# Altium schematic sheet SensorPCB.SchDoc
size A4; SheetNumber: 1; SheetTotal: 1
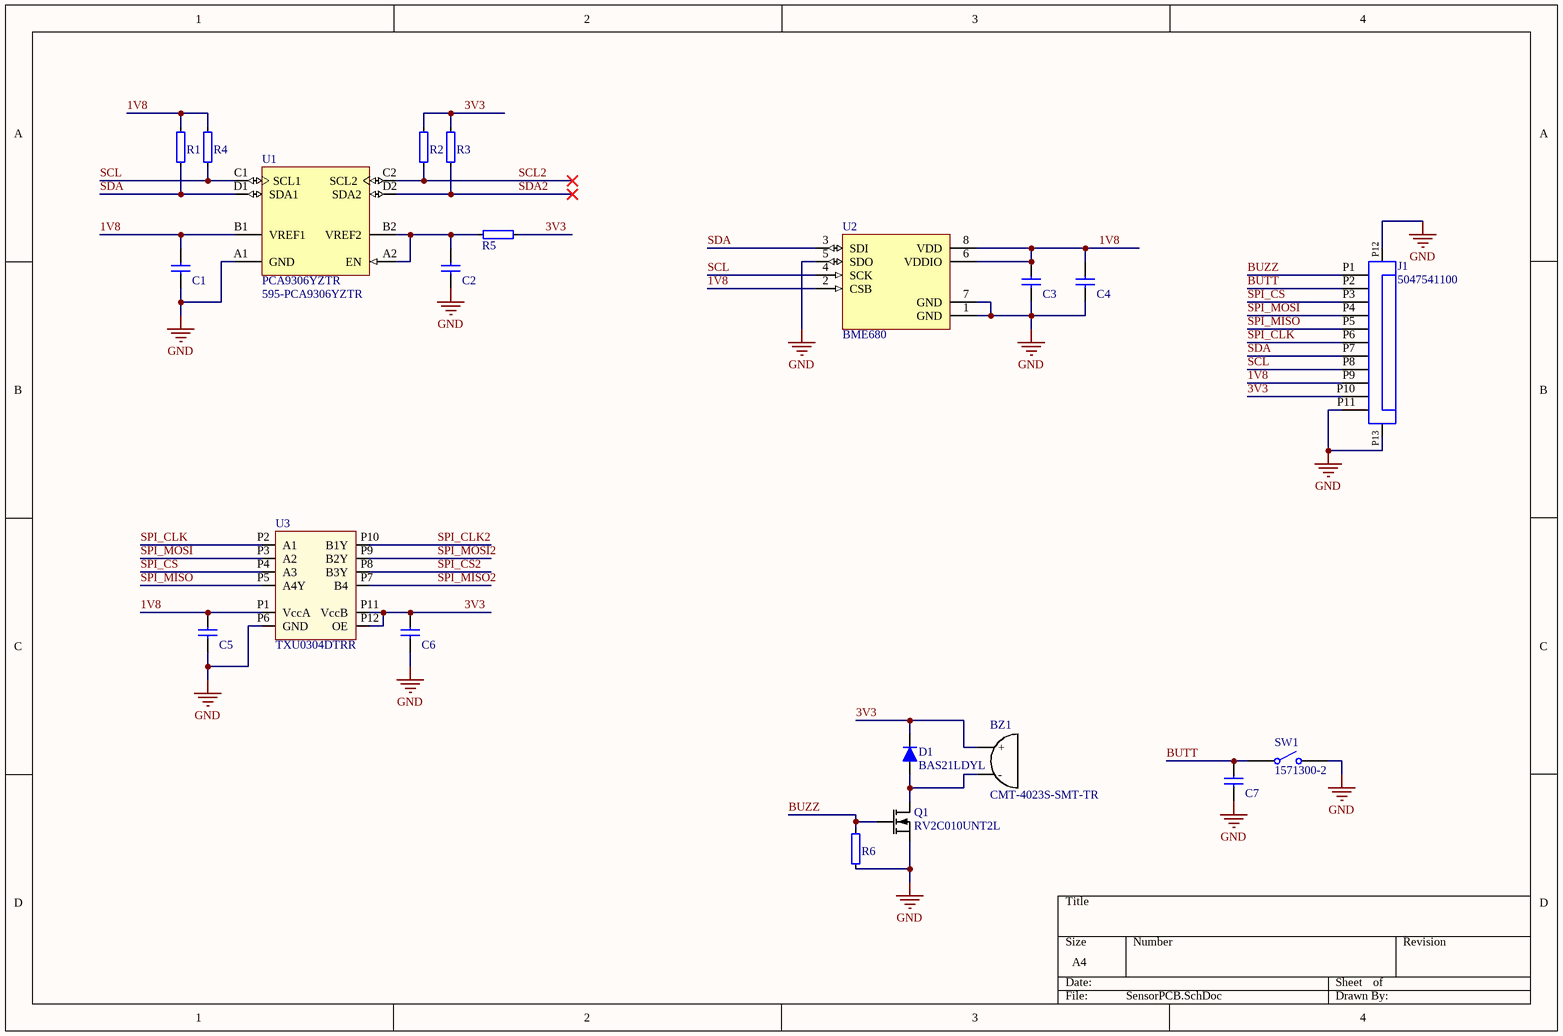
[diagram p0: SensorPCB.SchDoc]

## Parts
BZ1  CMT-4023S-SMT-TR  [CMT-4023S-SMT-TR]
C1  100n  [CAPC0603X03L_C]  (value not drawn)
C2  100n  [CAPC0603X03L_C]  (value not drawn)
C3  100n  [CAPC0603X03L_C]  (value not drawn)
C4  100n  [CAPC0603X03L_C]  (value not drawn)
C5  100n  [CAPC0603X03L_C]  (value not drawn)
C6  100n  [CAPC0603X03L_C]  (value not drawn)
C7  100n  [CAPC0603X03L_C]  (value not drawn)
D1  BAS21LDYL  [BAS21LDYL]
J1  5047541100  [5047541100]
Q1  RV2C010UNT2L  [DFN65P100X40-3L]
R1  4.7k  [RESC0603X03L_C]  (value not drawn)
R2  4.7k  [RESC0603X03L_C]  (value not drawn)
R3  4.7k  [RESC0603X03L_C]  (value not drawn)
R4  4.7k  [RESC0603X03L_C]  (value not drawn)
R5  200k  [RESC0603X03L_C]  (value not drawn)
R6  200k  [RESC0603X03L_C]  (value not drawn)
SW1  1571300-2  [1571300-2]
U1  PCA9306YZTR  Supplier Part Number 1: 595-PCA9306YZTR  [PCA9306YZTR]
U2  BME680  [BME680]
U3  TXU0304DTRR  [TXU0304DTR]

## Nets
GND: C1.1 C2.1 C3.1 C4.1 C5.1 C6.1 C7.1 J1.P11 J1.P12(MP1) J1.P13(MP2) Q1.2(S) R6.2 SW1.P2 U1.A1(GND) U2.1(GND) U2.5(SDO) U2.7(GND) U3.P6(GND)
1V8: C1.2 C3.2 C4.2 C5.2 J1.P9 R1.2 R4.2 U1.B1(VREF1) U2.2(CSB) U2.6(VDDIO) U2.8(VDD) U3.P1(VccA)
3V3: BZ1.P1(+) C6.2 D1.P2(K) J1.P10 R2.2 R3.2 R5.1 U3.P11(VccB) U3.P12(OE)
BUTT: C7.2 J1.P2 SW1.P1
BUZZ: J1.P1 Q1.1(G) R6.1
SCL: J1.P8 R4.1 U1.C1(SCL1) U2.4(SCK)
SCL2: R2.1 U1.C2(SCL2)
SDA: J1.P7 R1.1 U1.D1(SDA1) U2.3(SDI)
SDA2: R3.1 U1.D2(SDA2)
SPI_CLK: J1.P6 U3.P2(A1)
SPI_CLK2: U3.P10(B1Y)
SPI_CS: J1.P3 U3.P4(A3)
SPI_CS2: U3.P8(B3Y)
SPI_MISO: J1.P5 U3.P5(A4Y)
SPI_MISO2: U3.P7(B4)
SPI_MOSI: J1.P4 U3.P3(A2)
SPI_MOSI2: U3.P9(B2Y)
NetBZ1_P2: BZ1.P2(-) D1.P1(A) Q1.3(D)
NetC2_2: C2.2 R5.2 U1.A2(EN) U1.B2(VREF2)

## Library data of the parts
BZ1 = CMT-4023S-SMT-TR: 4 mm, 3 Vo-p, 70 dB, Surface Mount (SMT), Magnetic Audio Transducer Buzzer; Manufacturer: CUI; Voltage Rating: 3V; Frequency: 4kHz; Operating Supply Current: 90mA; Supplier 1: Mouser; Manufacturer Part Number: CMT-4023S-SMT-TR; RoHS: No; Category: Audio Products; Mount: Surface Mount; Min Operating Temperature: -20°C; Max Operating Temperature: 70°C; Sensing Method: Magnetic; Packaging: Tape and Reel; Termination: Solder; Length: 4mm; Width: 4mm; Lead Free: Lead Free; ComponentLink1URL: https://www.cui.com/product/resource/digikeypdf/cmt-4023s-smt.pdf?src-supplier=Digi-Key; ComponentLink1Description: https://www.cui.com/product/resource/digikeypdf/cmt-4023s-smt.pdf?src-supplier=Digi-Key; ComponentLink2URL: http://www.cui.com/product/resource/digikeypdf/cmt-4023s-smt.pdf?src-supplier=Digi-Key; ComponentLink2Description: http://www.cui.com/product/resource/digikeypdf/cmt-4023s-smt.pdf?src-supplier=Digi-Key; Supplier Part Number 1: 490-CMT-4023S-SMT-TR
C1-C7 = C0201
D1 = BAS21LDYL: BAS21LD/SOD882/SOD2; Manufacturer: Nexperia; Supplier 1: Mouser; Manufacturer Part Number: BAS21LDYL; RoHS: No; Stock 1: 752; Pricing 1: 1=0.30000, 10=0.23700, 50=0.23700, 100=0.12600, 1000=0.05700, 10000=0.03900 (USD); Supplier Part Number 1: 771-BAS21LDYL
J1 = 5047541100: Conn FFC/FPC Connector SKT 11 POS 0.3mm Solder RA SMD Easy-On™ T/R; Manufacturer Part Number: 687124182122; Manufacturer: Wurth Elektronik; Pitch: 0.5mm; Contact Resistance: 30mOhm; Pin Number: 24; Working Voltage: 50VAC; Rated Current: 0.5A; ComponentLink1Description: Manufacturer; ComponentLink1URL: http://www.we-online.de; ComponentLink2Description: Datasheet; ComponentLink2URL: https://katalog.we-online.com/em/datasheet/687124182122.pdf; Packaging: Tape and Reel; Published Date: March 2021; Mounting Technology: SMT; Operating Temperature: -25 to +85degC; Length: 14mm; Type: Horizontal; Supplier 1: Mouser; RoHS: No; Category: FFC / FPC; Stock 1: 21094; Pricing 1: 1=0.78000, 10=0.62000, 50=0.62000, 100=0.51700, 500=0.51200, 1000=0.51200, 5000=0.41900, 10000=0.41100, 25000=0.35200 (USD); ComponentLink3URL: https://www.molex.com/pdm_docs/ps/PS-504754-002.pdf?src-supplier=Digi-Key; ComponentLink3Description: https://www.molex.com/pdm_docs/ps/PS-504754-002.pdf?src-supplier=Digi-Key; Supplier Part Number 1: 538-504754-1100
Q1 = RV2C010UNT2L: N-Channel MOSFET, 20V, 1A, 470mOhm, 400mW; Manufacturer: Rohm Semiconductor; Part number IPS: 00000009976; Note: N.A.; Artikkelnr Noca: 35010020; Pad Count: 3; Part Number: RV2C010UNT2L; Manufacturer Part Number: RV2C010UNT2L; Footprint Doc: DFN-3; LatestRevisionDate: 2016-08-09; Published: 2016-08-09; Value: RV2C010UNT2L; ComponentLink1URL: N.A.; ComponentLink1Description: Datasheet; ComponentLink2URL: N.A.; ComponentLink2Description: Supplier link; HelpURL: http://rohmfs.rohm.com/en/products/databook/datasheet/discrete/transistor/mosfet/rv2c010unt2l-e.pdf; Supplier 1: Digi-Key; Supplier Part Number 1: RV2C010UNT2LCT-ND; Supplier 2: Mouser; Supplier Part Number 2: 755-RV2C010UNT2L; Component Class: Semiconductors; PartId: 101300132
R1-R6 = R0201
SW1 = 1571300-2: Switch Tactile OFF (ON) SPST Round Button Gull Wing 0.05A 12VDC 1.27N SMD Loose Piece; Manufacturer: TE Connectivity; Supplier 1: Mouser; Manufacturer Part Number: 1571300-2; RoHS: Yes; Category: Pushbutton Switches; Stock 1: 17816; Pricing 1: 1=0.69000, 10=0.66000, 50=0.62500, 100=0.55100, 1000=0.41800, 10000=0.39300 (USD); ComponentLink1URL: https://datasheet.ciiva.com/2901/eng-cd-1571300-j-2901544.pdf?src-supplier=Digi-Key; ComponentLink1Description: https://datasheet.ciiva.com/2901/eng-cd-1571300-j-2901544.pdf?src-supplier=Digi-Key; ComponentLink2URL: https://datasheet.ciiva.com/30102/eng-cat-1308390-0904-e26-e28-30102661.pdf?src-supplier=Onlinecomponents.com; ComponentLink2Description: https://datasheet.ciiva.com/30102/eng-cat-1308390-0904-e26-e28-30102661.pdf?src-supplier=Onlinecomponents.com; ComponentLink3URL: https://datasheet.ciiva.com/15226/getdatasheetpartid-240878-15226635.pdf?src-supplier=Verical; ComponentLink3Description: https://datasheet.ciiva.com/15226/getdatasheetpartid-240878-15226635.pdf?src-supplier=Verical; ComponentLink4URL: https://datasheet.ciiva.com/8164/eng-cs-1308111-1-switches-core-program-catalog-0308-8164774.pdf?src-supplier=Avnet; ComponentLink4Description: https://datasheet.ciiva.com/8164/eng-cs-1308111-1-switches-core-program-catalog-0308-8164774.pdf?src-supplier=Avnet; Supplier Part Number 1: 571-15713002
U1 = PCA9306YZTR: PCA9306 2-BIT Bidirectional I2C; Manufacturer: Texas Instruments; On-Chip Power-on-Reset: No; Vcc range(V): 0 to 5.5; 5V Tolerant I/O: Yes; Function: Voltage Translator; Max Frequency(kHz): 400; SubFamily: I2C Special Function; No. of Outputs: 2; Eco-Plan: Green (RoHS & no Sb/Br); tpd max(ns): 1.5; Rating: Catalog; Min Supply Voltage: 1.2V; Max Supply Voltage: 5.5V; Propagation Delay: 0.3ns; Logic Function: Translator; ComponentLink2Description: Package Specification; PackageVersion: revF, Oct-2006; Mounting Technology: Surface Mount; Open Drain I/O Type: Yes; PackageReference: YZT8; PackageDescription: 8-Ball Die-Size Ball Grid Array, 1.9 x 0.9 mm Body, 0.5 mm Pitch, Pb-Free; ComponentLink1URL: http://www.ti.com/general/docs/lit/getliterature.tsp?genericPartNumber=PCA9306&fileType=pdf; ComponentLink2URL: http://www.ti.com/litv/pdf/mpds049b; DatasheetVersion: SCPS113J; fSCLK(Max)(MHz): 400; Enable Pin: Yes; ComponentLink1Description: Datasheet; PartNumber: PCA9306YZTR; Supplier 1: Mouser; Manufacturer Part Number: PCA9306YZTR; RoHS: Yes; Category: Voltage Level Shifters; Pricing 1: 1=0.97000, 10=0.87600, 25=0.83100, 50=0.83100, 100=0.68300, 250=0.63900, 500=0.56400, 1000=0.44600, 10000=0.44600 (USD); Number of Pins: 8; Weight: 8.1E-05oz; Contact Plating: Copper,Tin,Silver; Min Operating Temperature: -40°C; Max Operating Temperature: 85°C; Package Quantity: 3000; Number of Channels: 2; Packaging: Tape and Reel; Number of Bits: 2; Output Type: I2C; Series: -; Number of Outputs: 2; REACH SVHC: No SVHC; Lead Free: Lead Free; RoHS Compliant: Yes; ComponentLink3URL: https://datasheet.ciiva.com/1504/1862428-1504150.pdf?src-supplier=Element14; ComponentLink3Description: https://datasheet.ciiva.com/1504/1862428-1504150.pdf?src-supplier=Element14; ComponentLink4URL: https://datasheet.ciiva.com/1899/pca9306-1899336.pdf?src-supplier=Digi-Key; ComponentLink4Description: https://datasheet.ciiva.com/1899/pca9306-1899336.pdf?src-supplier=Digi-Key; ComponentLink5URL: https://datasheet.ciiva.com/1899/pca9306-1899335.pdf?src-supplier=Digi-Key; ComponentLink5Description: https://datasheet.ciiva.com/1899/pca9306-1899335.pdf?src-supplier=Digi-Key; ComponentLink6URL: https://datasheet.ciiva.com/1899/pca9306-1899337.pdf?src-supplier=Digi-Key; ComponentLink6Description: https://datasheet.ciiva.com/1899/pca9306-1899337.pdf?src-supplier=Digi-Key
U2 = BME680: Low power gas, pressure, temperature & humidity sensor; Manufacturer: Bosch; Part number IPS: 00000001800; Note: N.A.; Pad Count: 8; Part Number: BME680; Manufacturer Part Number: BME680; Footprint Doc: LGA-8; LatestRevisionDate: 2018-05-24; Published: 2018-05-24; Value: BME680; Artikkelnr Noca: N.A.; ComponentLink1URL: https://ae-bst.resource.bosch.com/media/_tech/media/datasheets/BST-BME680-DS001-00.pdf; ComponentLink1Description: Datasheet; ComponentLink2Description: Supplier link; HelpURL: N.A.; Supplier 1: Digi-Key; Supplier Part Number 1: 828-1077-1-ND; Supplier 2: N.A.; Supplier Part Number 2: N.A.; Component Class: Misc_ICs; PartId: 101900532; ComponentLink2URL: N.A.
U3 = TXU0304DTRR: Four-channel fixed multidirectional level shifter 12-X2QFN -40 to 125; Manufacturer: Texas Instruments; Supplier 1: Mouser; Manufacturer Part Number: TXU0304DTRR; RoHS: No; Pricing 1: 1=0.87000, 10=0.78200, 50=0.74200, 100=0.61000, 1000=0.39800, 10000=0.38500 (USD); Supplier Part Number 1: 595-TXU0304DTRR